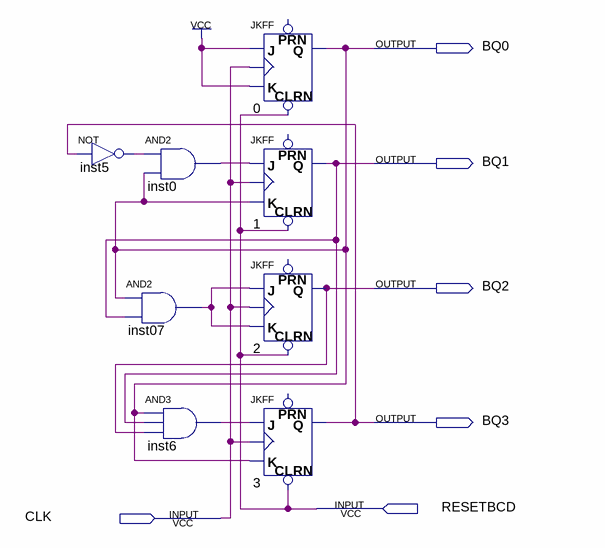
[diagram p0: schematic sheet]
// Quartus schematic BCD.bdf as structural Verilog: 8 symbols, 6 pins
module BCD (
  input  RESETBCD,
  input  CLK,
  output BQ0,
  output BQ1,
  output BQ2,
  output BQ3
);

  wire inst0_out, inst5_out, inst6_out, inst07_out;

  not inst5 (inst5_out, BQ3);
  and inst0 (inst0_out, inst5_out, BQ0);
  and inst07 (inst07_out, BQ0, BQ1);
  and inst6 (inst6_out, BQ0, BQ1, BQ2);
  JKFF u_0 (.CLRN(RESETBCD), .K(1'b1), .J(1'b1), .CLK(CLK), .Q(BQ0));  // open: PRN
  JKFF u_1 (.CLRN(RESETBCD), .K(BQ0), .J(inst0_out), .CLK(CLK), .Q(BQ1));  // open: PRN
  JKFF u_2 (.CLRN(RESETBCD), .K(inst07_out), .J(inst07_out), .CLK(CLK), .Q(BQ2));  // open: PRN
  JKFF u_3 (.CLRN(RESETBCD), .K(BQ0), .J(inst6_out), .CLK(CLK), .Q(BQ3));  // open: PRN
endmodule
